# EAGLE design Air Pressure Sensor Breakout (EAGLE 5.12)
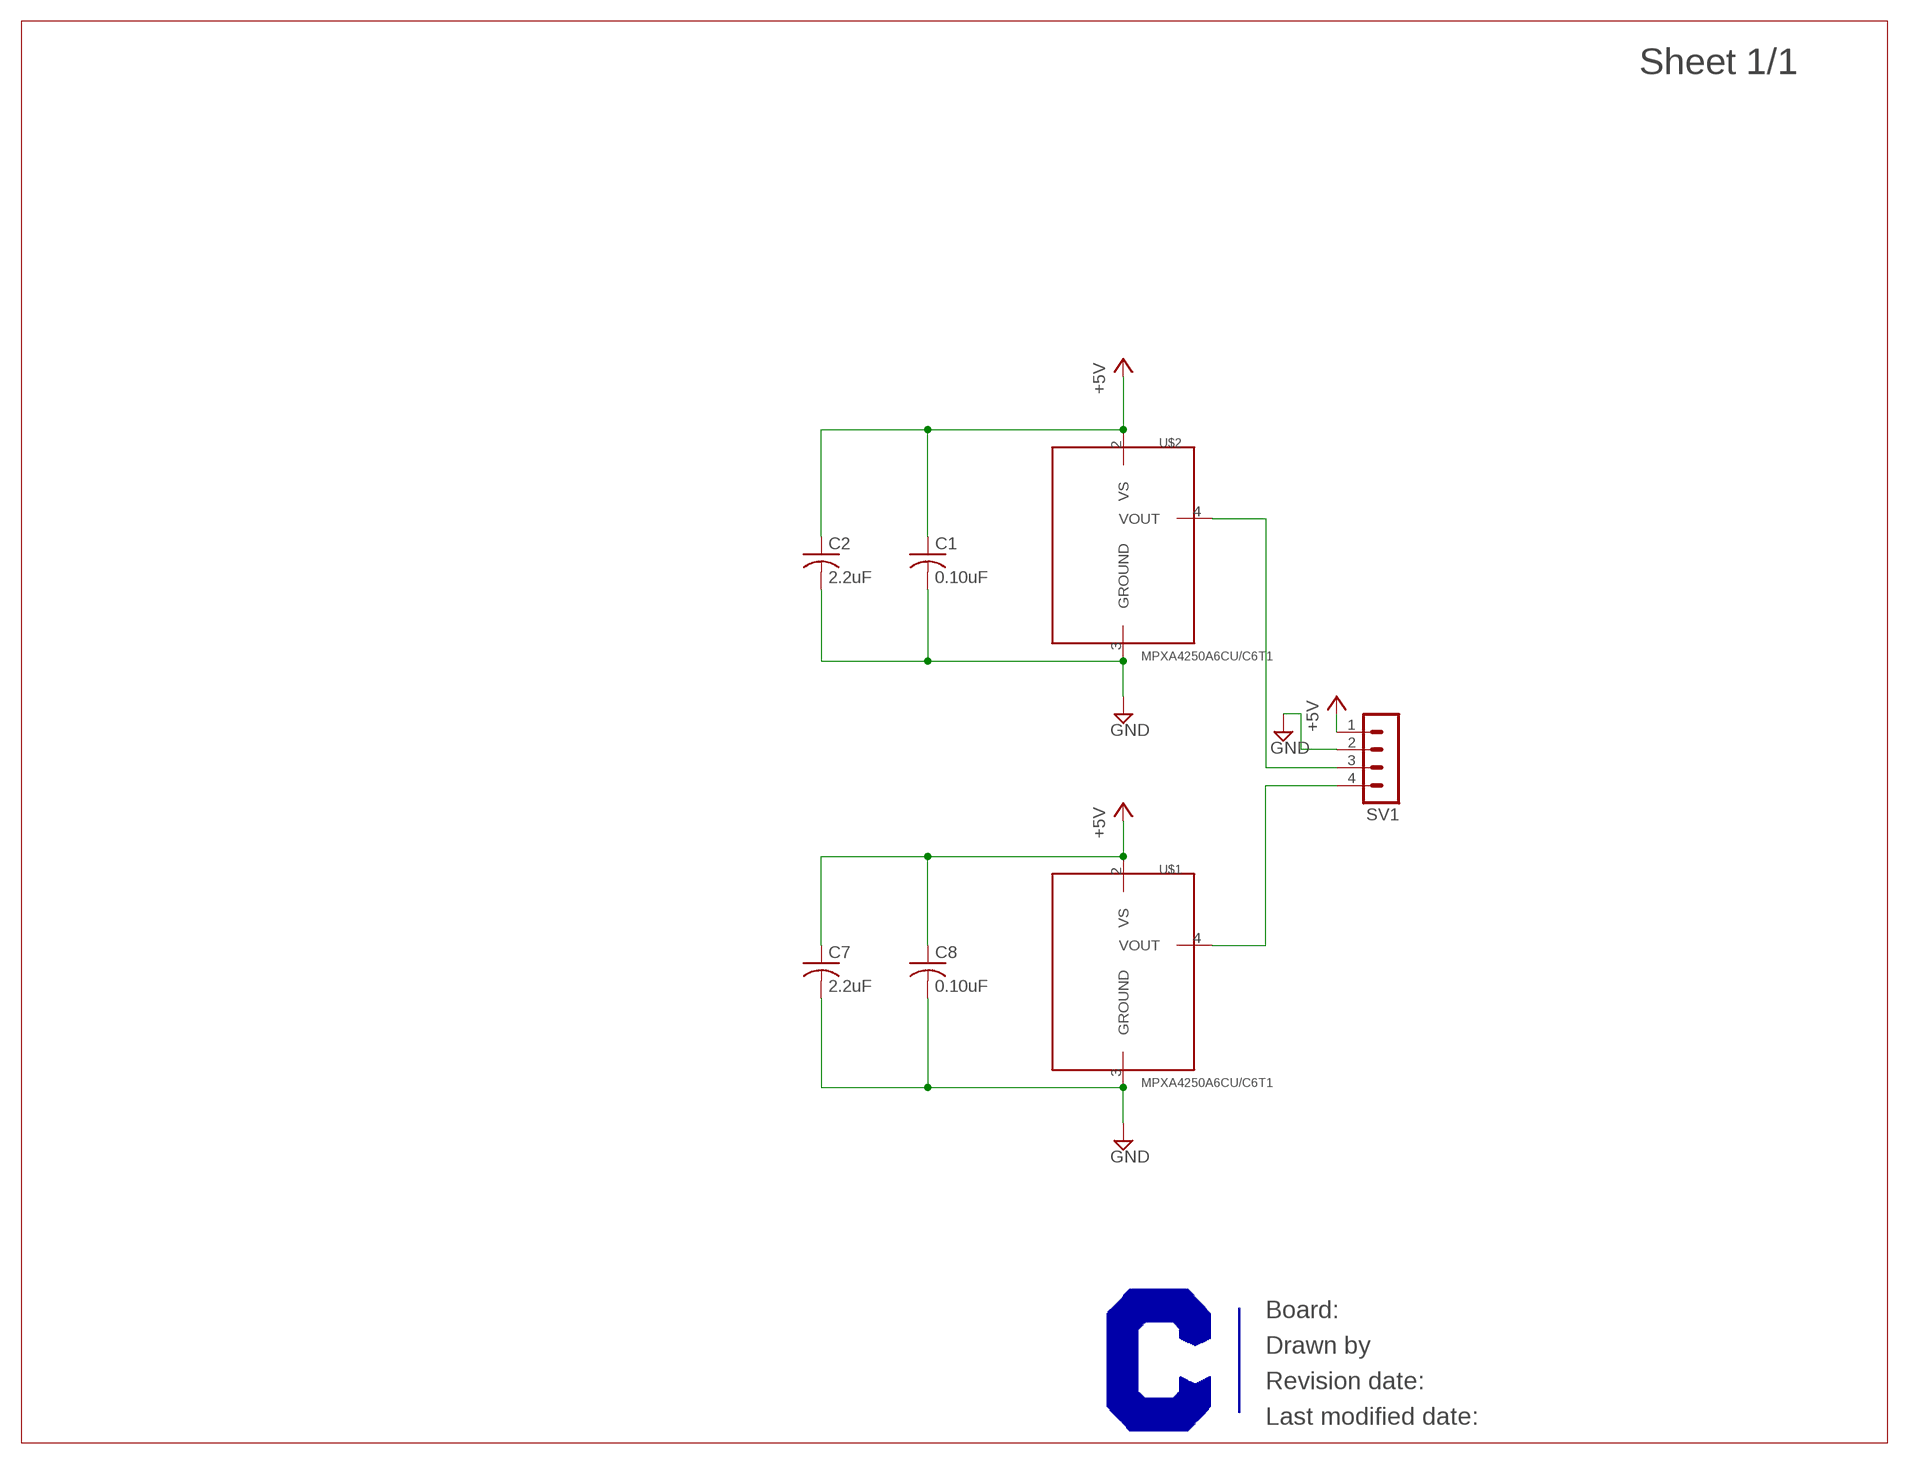
[diagram p0: schematic, sheet 1]

## Parts
C1  0.10uF  C-USC0603  [C0603]
C2  2.2uF  C-USC0603  [C0603]
C7  2.2uF  C-USC0603  [C0603]
C8  0.10uF  C-USC0603  [C0603]
SV1  MA04-1  [MA04-1]
U$1  MPXA4250A6CU/C6T1  [MPXA4250AC6U/C6T1]
U$2  MPXA4250A6CU/C6T1  [MPXA4250AC6U/C6T1]
U$3  CURRENT-C-LETTER-LANDSCAPE  [BLANK]

## Nets
+5V: C1.1 C2.1 C7.1 C8.1 SV1.1 U$1.2(VS) U$2.2(VS)
GND: C1.2 C2.2 C7.2 C8.2 SV1.2 U$1.3(GROUND) U$2.3(GROUND)
N$8: SV1.3 U$2.4(VOUT)
N$9: SV1.4 U$1.4(VOUT)

## Library data of the parts
C1 C2 C7 C8 = rcl:C-US: CAPACITOR, American symbol
SV1 = con-lstb:MA04-1: PIN HEADER; OC_FARNELL: unknown; OC_NEWARK: unknown
U$1 U$2 = Freescale:MPXA4250A6CU/C6T1: Datasheet: http://cache.freescale.com/files/sensors/doc/data_sheet/MPX4250A.pdf M.R. 2-15-15; PARTNO: MPXA4250A6CU/C6T1
U$3 = Frames:CURRENT-C-LETTER-LANDSCAPE; BOM: EXCLUDE

## Board
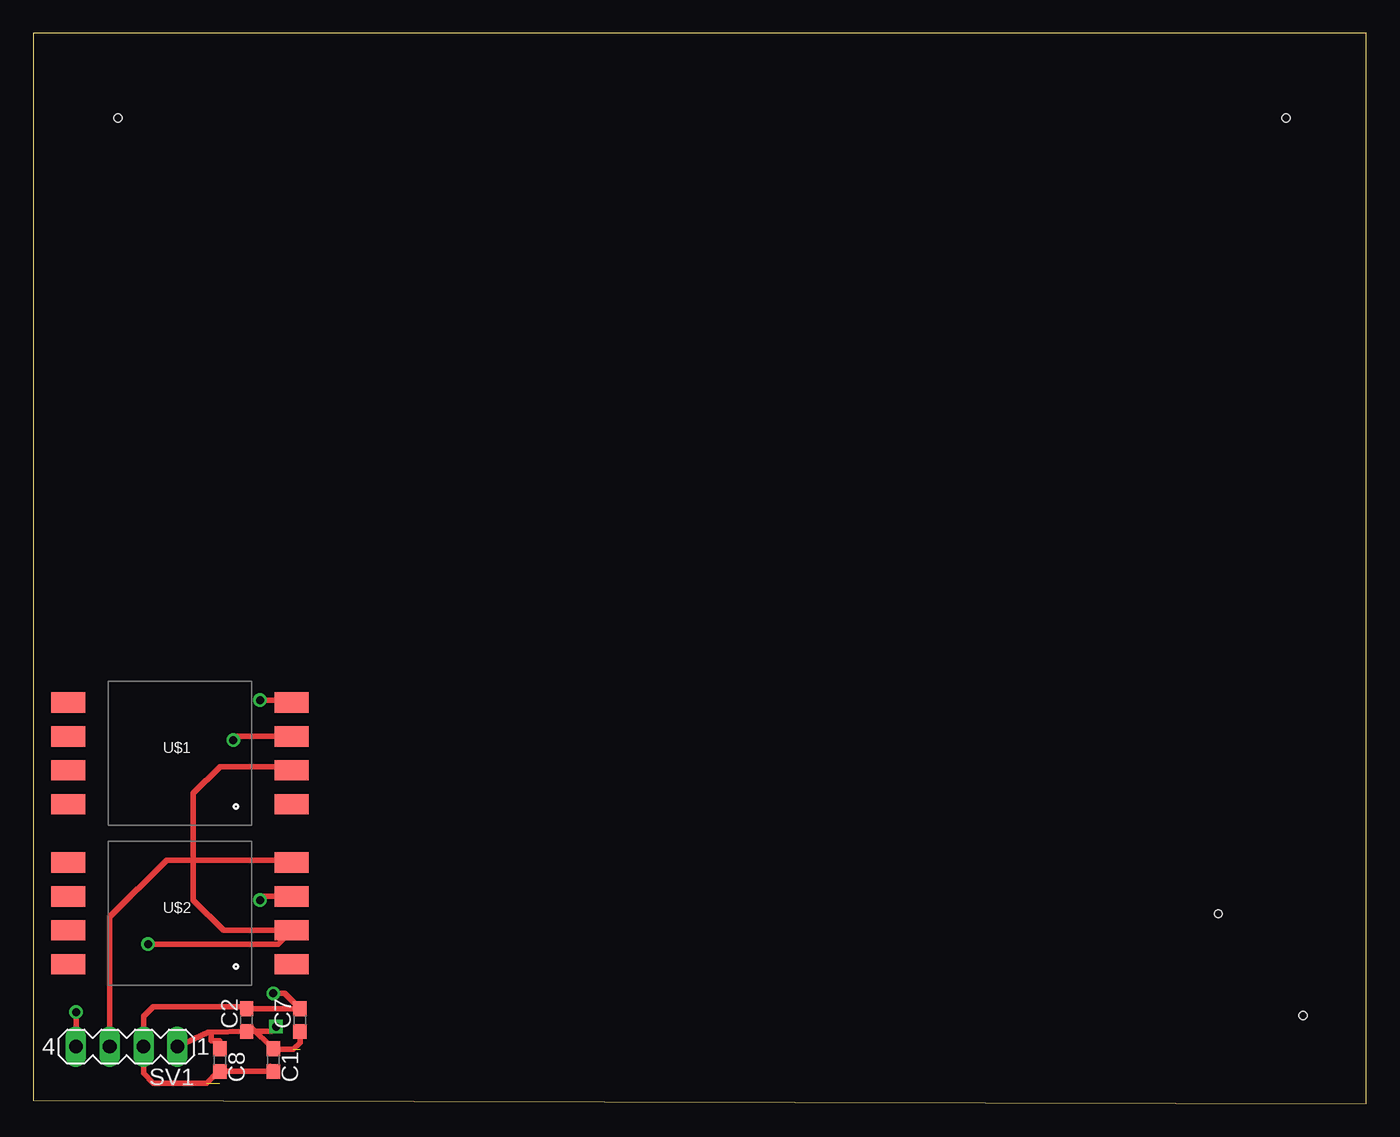
[diagram p1: board, top side]
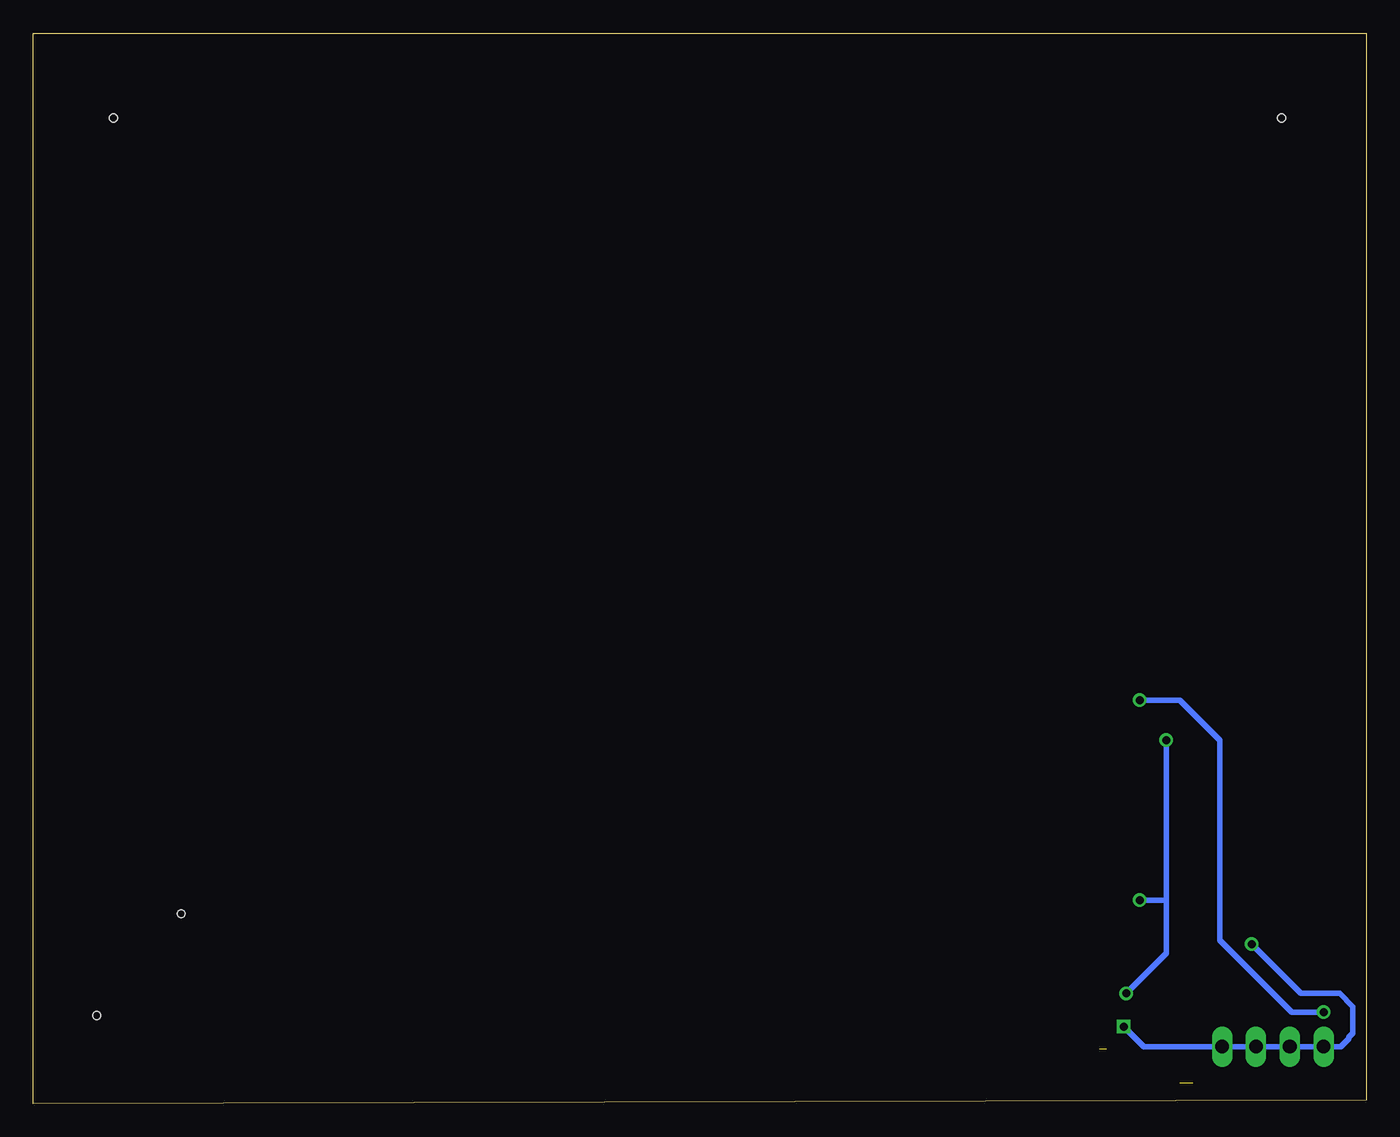
[diagram p2: board, bottom side, seen from below]

Size 100 x 80.27 mm. Coordinates in mm from the lower left corner, seen from the top.
Outline: 0,0.27 100,0 100,80.27 0,80.27 0,0.27
Copper layers (1*16): Top 0.035mm / dielectric 1.5mm / Bottom 0.035mm
Design rules "default": minimum track width 10mil, minimum drill 24mil, track to track 8mil, track to pad 8mil, pad to pad 8mil, via to via 8mil, smd to smd 8mil, copper to edge 40mil, drill to drill 8mil, minimum pad ring 10mil, minimum via ring 8mil, stop-mask expansion 4mil, vias tented up to drill 0mil, thermal gap 10mil
Holes 0.6 mm at 6.35,73.93 93.98,73.93 95.25,6.62 88.9,14.24

### Footprints (pad centres in the part's own frame; a part is rotated, then mirrored left to right if it is on the bottom)
C0603 = smd 1.1 x 1: 1 -0.85,0; 2 0.85,0
MA04-1 = drill 1.016 long: 1 -3.81,0; 2 -1.27,0; 3 1.27,0; 4 3.81,0
MPXA4250AC6U/C6T1 = smd 2.54 x 1.52: 1 8.38,-3.81; 2 8.38,-1.27; 3 8.38,1.27; 4 8.38,3.81; 5 -8.38,3.81; 6 -8.38,1.27; 7 -8.38,-1.27; 8 -8.38,-3.81

### Placement (x,y rotation side)
C1  18,3.27 270 top
C2  16,6.27 90 top
C7  20,6.27 90 top
C8  14,3.27 270 top
SV1  7,4.27 180 top
U$1  11,26.27 0 top
U$2  11,14.27 0 top
U$3  -19.05,33.29 0 top  (outside the outline)

### Tracks (layer width: path | path; a pad name or v marks a point on that pad's centre or on a via)
+5V  (via drill 0.6)  (1 unrouted)
  Top 0.406: C2.1 13.34,5.37 | SV1.1 13.12,5.37 13.34,5.37 | C2.1 16.3,5.77 C1.1 17.78,4.08 19.5,4.08 20,4.58 C7.1 | 13.34,5.37 13.34,4.71 13.97,4.71 C8.1 | v18.2,5.77 17.85,5.42 C2.1 | U$1.2 19.11,25.27 14,25.27 12,23.27 12,15.27 14.27,13 U$2.2 18.35,11.97 v8.6,11.97
  Bottom 0.406: v8.6,11.97 4.9,8.27 2,8.27 1,7.27 1,5.27 1.3,4.97 1.3,4.87 1.9,4.27 16.7,4.27 v18.2,5.77
GND  (via drill 0.6)  (1 unrouted)
  Top 0.406: 17.78,2.81 C1.2 C8.2 13.88,2.42 13,1.54 9,1.54 8.27,2.27 SV1.2 8.27,6.54 9,7.27 15.85,7.27 C2.2 C7.2 18.85,8.27 v18,8.27 | U$1.3 15.27,27.54 v15,27.27 | U$2.3 17.27,15.54 v17,15.27
  Bottom 0.406: 15,15.27 15,11.27 v18,8.27 | 15,15.27 v15,27.27 | 15,15.27 v17,15.27
N$8
  Top 0.406: U$2.4 19.19,18.27 10,18.27 5.73,14 SV1.3
N$9  (via drill 0.6)
  Top 0.406: SV1.4 v3.2,6.87 | v17,30.27 19.19,30.27 U$1.4
  Bottom 0.406: v3.2,6.87 5.6,6.87 11,12.27 11,27.27 14,30.27 v17,30.27